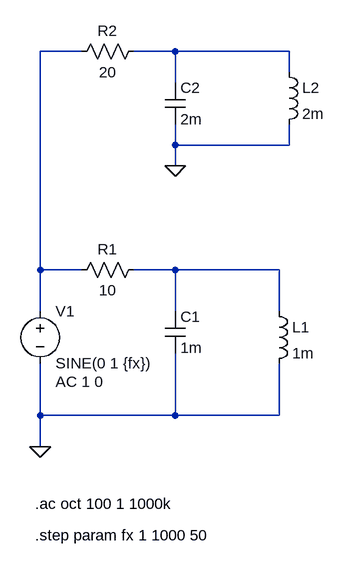
[diagram p0: schematic parallel-lc-2.asc]
parallel-lc-2.asc, the LTspice schematic file:
Version 4.1
SHEET 1 880 680
WIRE -128 -208 -192 -208
WIRE 16 -208 -48 -208
WIRE 192 -208 16 -208
WIRE 192 -176 192 -208
WIRE 16 -160 16 -208
WIRE 16 -64 16 -96
WIRE 192 -64 192 -96
WIRE 192 -64 16 -64
WIRE 16 -32 16 -64
WIRE -192 128 -192 -208
WIRE -128 128 -192 128
WIRE 16 128 -48 128
WIRE 176 128 16 128
WIRE -192 192 -192 128
WIRE 16 192 16 128
WIRE 176 192 176 128
WIRE -192 352 -192 272
WIRE 16 352 16 256
WIRE 16 352 -192 352
WIRE 176 352 176 272
WIRE 176 352 16 352
WIRE -192 400 -192 352
FLAG -192 400 0
FLAG 16 -32 0
SYMBOL voltage -192 176 R0
WINDOW 123 24 124 Left 2
WINDOW 39 0 0 Left 0
SYMATTR InstName V1
SYMATTR Value SINE(0 1 {fx})
SYMATTR Value2 AC 1 0
SYMBOL cap 0 192 R0
SYMATTR InstName C1
SYMATTR Value 1m
SYMBOL ind 160 176 R0
SYMATTR InstName L1
SYMATTR Value 1m
SYMBOL res -144 144 R270
WINDOW 0 32 56 VTop 2
WINDOW 3 0 56 VBottom 2
SYMATTR InstName R1
SYMATTR Value 10
SYMBOL res -32 -224 R90
WINDOW 0 0 56 VBottom 2
WINDOW 3 32 56 VTop 2
SYMATTR InstName R2
SYMATTR Value 20
SYMBOL ind 176 -192 R0
SYMATTR InstName L2
SYMATTR Value 2m
SYMBOL cap 0 -160 R0
SYMATTR InstName C2
SYMATTR Value 2m
TEXT -200 488 Left 2 !.ac oct 100 1 1000k
TEXT -200 536 Left 2 !.step param fx 1 1000 50

The netlist it stands for:
* parallel-lc-2.asc
V1 N001 0 SINE(0 1 {fx}) AC 1 0
C1 N003 0 1m
L1 N003 0 1m
R1 N001 N003 10
R2 N002 N001 20
L2 N002 0 2m
C2 N002 0 2m
.ac oct 100 1 1000k
.step param fx 1 1000 50
.backanno
.end